# Altium schematic sheet pulse_mux.SchDoc.bak.SchDoc
size A
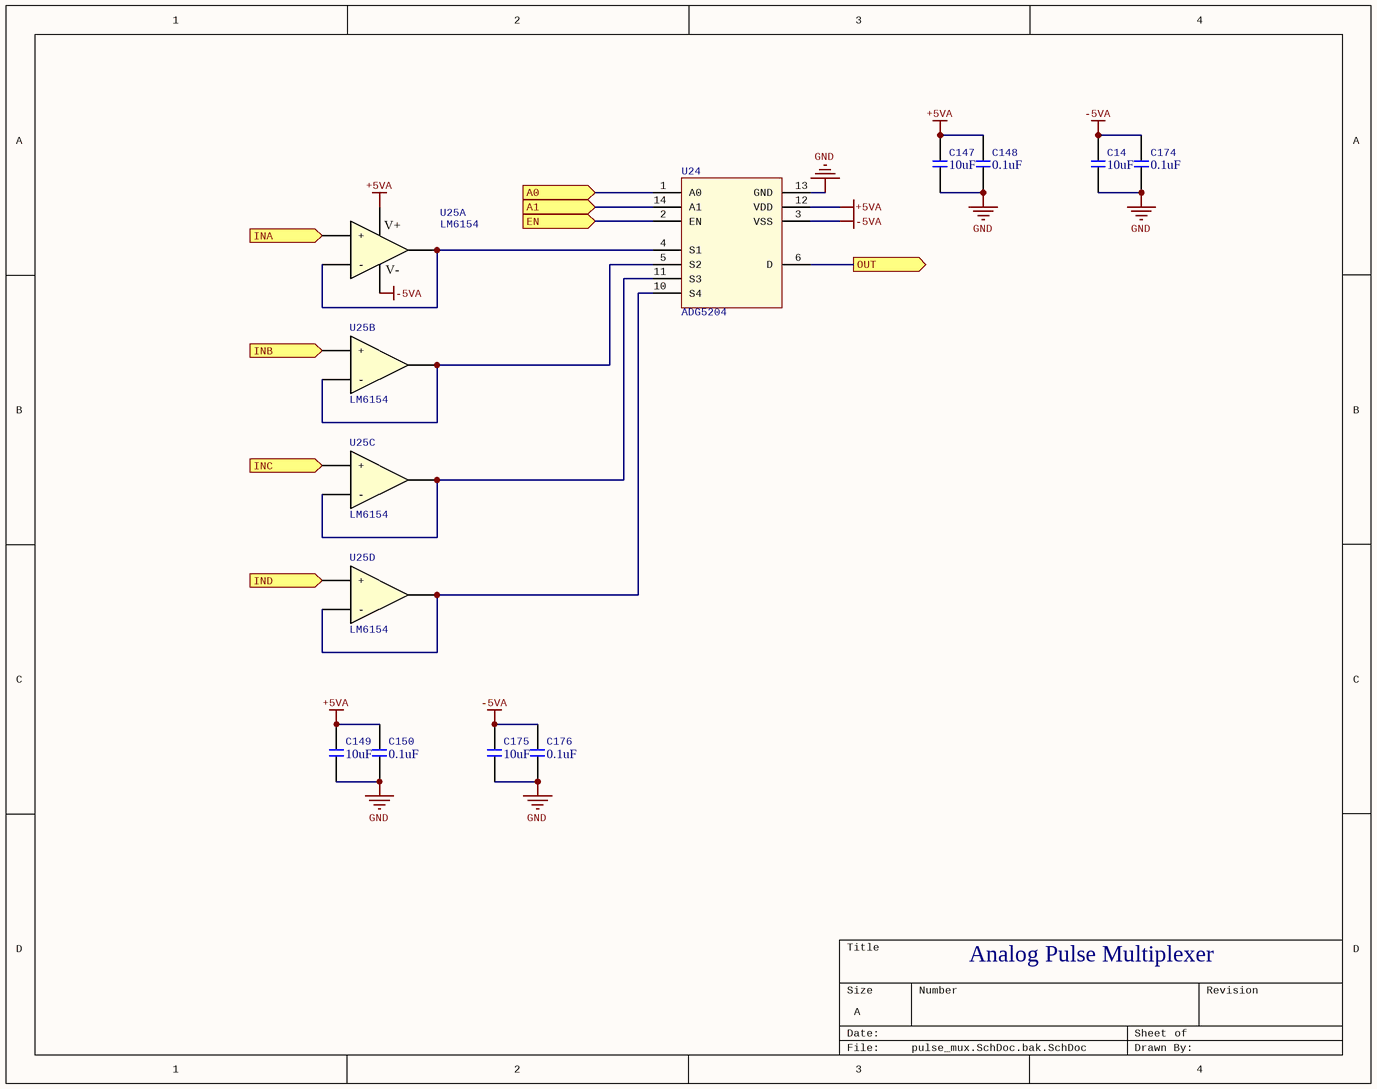
[diagram p0: pulse_mux.SchDoc.bak.SchDoc]

## Parts
C14  10uF  [C0603]
C147  10uF  [C0603]
C148  0.1uF  [C0402]
C149  10uF  [C0603]
C150  0.1uF  [C0402]
C174  0.1uF  [C0402]
C175  10uF  [C0603]
C176  0.1uF  [C0402]
U24  ADG5204  [TSSOP-14]
U25  LM6154  [SOIC-14]  (parts A,B,C,D of 4)

## Ports
A0 (in), A1 (in), EN (in), INA (in), INB (in), INC (in), IND (in), OUT (out)

## Nets
+5VA: C147.2 C148.2 C149.2 C150.2 U24.12(VDD) U25.4(V+)
-5VA: C14.2 C174.2 C175.2 C176.2 U24.3(VSS) U25.11(V-)
GND: C14.1 C147.1 C148.1 C149.1 C150.1 C174.1 C175.1 C176.1 U24.13(GND)
A0: U24.1(A0) ; port A0
A1: U24.14(A1) ; port A1
EN: U24.2(EN) ; port EN
INA: U25.3(+) ; port INA
INB: U25.5(+) ; port INB
INC: U25.10(+) ; port INC
IND: U25.12(+) ; port IND
OUT: U24.6(D) ; port OUT
NetU24_4: U24.4(S1) U25.1(OUT) U25.2(-)
NetU24_5: U24.5(S2) U25.6(-) U25.7(OUT)
NetU24_10: U24.10(S4) U25.13(-) U25.14(OUT)
NetU24_11: U24.11(S3) U25.8(OUT) U25.9(-)

Not connected (* = marked no-connect by the designer): U24 7(NC) 8(NC) 9(NC)

## Notes on the sheet
- Analog Pulse Multiplexer

## Library data of the parts
C14 C147 C149 C175 = C10uF
C148 C150 C174 C176 = C0.1uF: 0.1 uF SMD Capacitor
U24 = ADG5204: 4 Input Analog Multiplexer